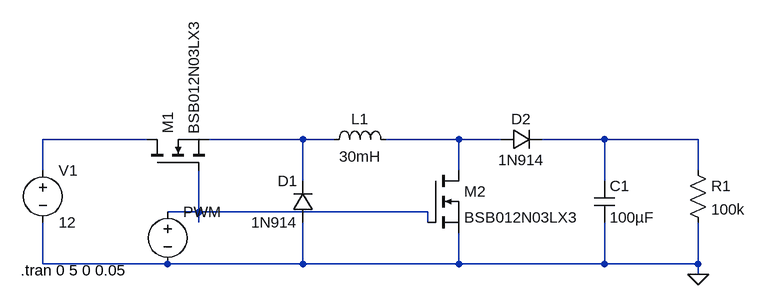
[diagram p0: schematic Non-Inverting Buck-Boost DCDC Converter.asc]
Non-Inverting Buck-Boost DCDC Converter.asc, the LTspice schematic file:
Version 4
SHEET 1 880 680
WIRE -112 -16 -272 -16
WIRE 128 -16 -16 -16
WIRE 176 -16 128 -16
WIRE 368 -16 256 -16
WIRE 432 -16 368 -16
WIRE 592 -16 496 -16
WIRE 736 -16 592 -16
WIRE -272 32 -272 -16
WIRE 368 32 368 -16
WIRE 736 32 736 -16
WIRE 128 48 128 -16
WIRE 592 48 592 -16
WIRE -32 96 -32 32
WIRE -32 96 -80 96
WIRE 320 96 -32 96
WIRE -32 112 -32 96
WIRE 320 112 320 96
WIRE -272 176 -272 112
WIRE -80 176 -272 176
WIRE 128 176 128 112
WIRE 128 176 -80 176
WIRE 368 176 368 128
WIRE 368 176 128 176
WIRE 592 176 592 112
WIRE 592 176 368 176
WIRE 736 176 736 112
WIRE 736 176 592 176
WIRE 736 192 736 176
FLAG 736 192 0
SYMBOL diode 144 112 R180
WINDOW 0 24 64 Left 2
WINDOW 3 24 0 Left 2
SYMATTR InstName D1
SYMATTR Value 1N914
SYMBOL voltage -272 16 R0
WINDOW 123 0 0 Left 0
WINDOW 39 0 0 Left 0
SYMATTR InstName V1
SYMATTR Value 12
SYMBOL nmos -112 32 R270
SYMATTR InstName M1
SYMATTR Value BSB012N03LX3
SYMBOL nmos 320 32 R0
SYMATTR InstName M2
SYMATTR Value BSB012N03LX3
SYMBOL diode 432 0 R270
WINDOW 0 32 32 VTop 2
WINDOW 3 0 32 VBottom 2
SYMATTR InstName D2
SYMATTR Value 1N914
SYMBOL ind 160 0 R270
WINDOW 0 32 56 VTop 2
WINDOW 3 5 56 VBottom 2
SYMATTR InstName L1
SYMATTR Value 30mH
SYMBOL cap 576 48 R0
SYMATTR InstName C1
SYMATTR Value 100µF
SYMBOL res 720 16 R0
SYMATTR InstName R1
SYMATTR Value 100k
SYMBOL voltage -80 80 R0
WINDOW 3 24 96 Invisible 2
WINDOW 123 0 0 Left 0
WINDOW 39 0 0 Left 0
SYMATTR InstName PWM
SYMATTR Value PULSE(0 25 0 0 0 0.125 0.25 100000)
TEXT -306 186 Left 2 !.tran 0 5 0 0.05

The netlist it stands for:
* Non-Inverting Buck-Boost DCDC Converter.asc
D1 0 N002 1N914
V1 N001 0 12
M1 N001 N005 N002 N002 BSB012N03LX3
M2 N003 N005 0 0 BSB012N03LX3
D2 N003 N004 1N914
L1 N002 N003 30mH
C1 N004 0 100µF
R1 N004 0 100k
V§PWM N005 0 PULSE(0 25 0 0 0 0.125 0.25 100000)
.model D D
.lib standard.dio
.model NMOS NMOS
.model PMOS PMOS
.lib standard.mos
.tran 0 5 0 0.05
.backanno
.end